# Altium schematic sheet main.SchDoc
size A2; Organization: Altium Limited; Address1: L3, 12a Rodborough Rd; Address2: Frenchs Forest; Address3: NSW; Address4: Australia 2086
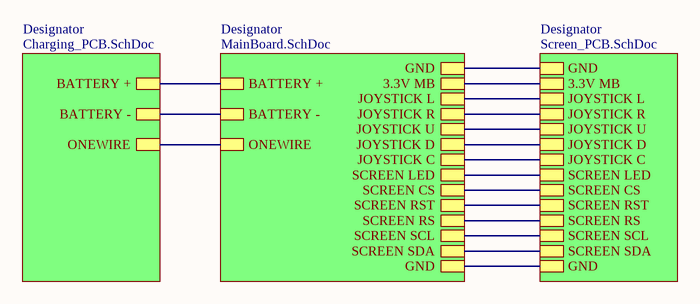
[diagram p0: main.SchDoc]

## Sub-sheets
Designator = Charging_PCB.SchDoc: BATTERY +, BATTERY -, ONEWIRE
Designator = MainBoard.SchDoc: BATTERY +, BATTERY -, ONEWIRE, GND, 3.3V MB, SCREEN CS, JOYSTICK D, SCREEN SCL, JOYSTICK U, SCREEN SDA, SCREEN RS, JOYSTICK R, JOYSTICK L, JOYSTICK C, SCREEN RST, SCREEN LED, GND
Designator = Screen_PCB.SchDoc: SCREEN LED, GND, GND, SCREEN SDA, JOYSTICK C, SCREEN CS, SCREEN SCL, JOYSTICK U, SCREEN RS, 3.3V MB, SCREEN RST, JOYSTICK R, JOYSTICK D, JOYSTICK L

## Nets
(unnamed): sheet Designator/BATTERY +, sheet Designator/BATTERY +
(unnamed): sheet Designator/BATTERY -, sheet Designator/BATTERY -
(unnamed): sheet Designator/ONEWIRE, sheet Designator/ONEWIRE
(unnamed): sheet Designator/GND, sheet Designator/GND
(unnamed): sheet Designator/3.3V MB, sheet Designator/3.3V MB
(unnamed): sheet Designator/SCREEN CS, sheet Designator/SCREEN CS
(unnamed): sheet Designator/JOYSTICK D, sheet Designator/JOYSTICK D
(unnamed): sheet Designator/SCREEN SCL, sheet Designator/SCREEN SCL
(unnamed): sheet Designator/JOYSTICK U, sheet Designator/JOYSTICK U
(unnamed): sheet Designator/SCREEN SDA, sheet Designator/SCREEN SDA
(unnamed): sheet Designator/SCREEN RS, sheet Designator/SCREEN RS
(unnamed): sheet Designator/JOYSTICK R, sheet Designator/JOYSTICK R
(unnamed): sheet Designator/JOYSTICK L, sheet Designator/JOYSTICK L
(unnamed): sheet Designator/JOYSTICK C, sheet Designator/JOYSTICK C
(unnamed): sheet Designator/SCREEN RST, sheet Designator/SCREEN RST
(unnamed): sheet Designator/SCREEN LED, sheet Designator/SCREEN LED
(unnamed): sheet Designator/GND, sheet Designator/GND

## Notes on the sheet
- Title
- Size:
- Date:
- File:
- A2
- Number:
- Time:
- Revision:
- Sheet
- of